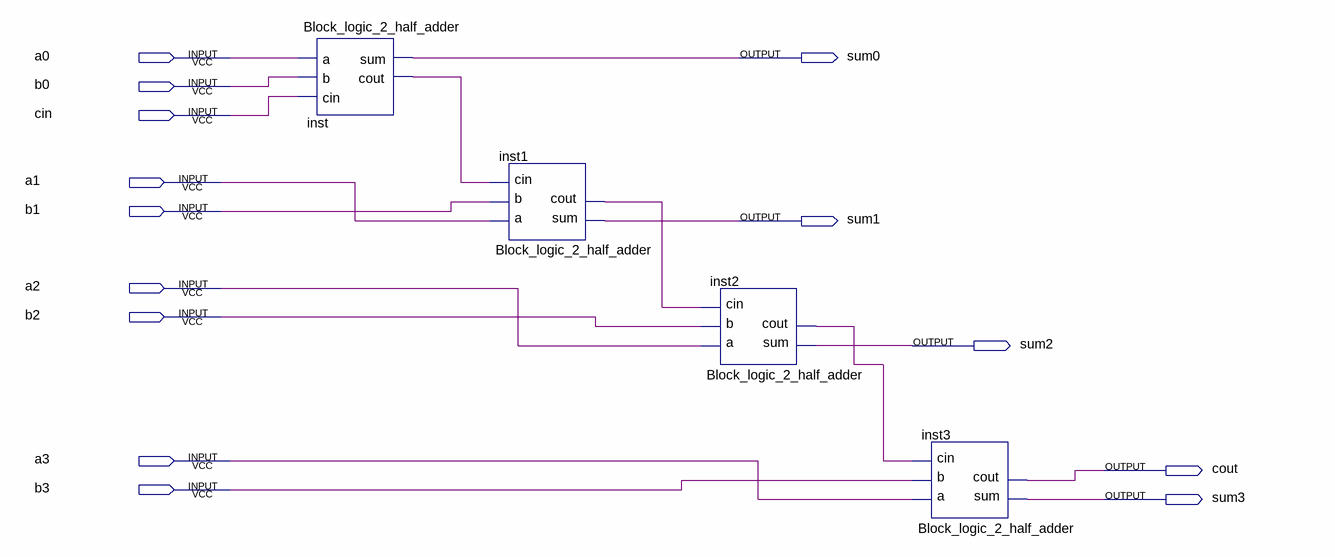
[diagram p0: schematic sheet]
// Quartus schematic Block_4_bit_full_adder.bdf as structural Verilog: 4 symbols, 14 pins
module Block_4_bit_full_adder (
  input  a0,
  input  b0,
  input  cin,
  input  a1,
  input  b1,
  input  a2,
  input  b2,
  input  a3,
  input  b3,
  output sum0,
  output sum1,
  output sum2,
  output cout,
  output sum3
);

  wire inst1_cout, inst2_cout, inst_cout;

  Block_logic_2_half_adder inst (.a(a0), .b(b0), .cin(cin), .sum(sum0), .cout(inst_cout));
  Block_logic_2_half_adder inst1 (.a(a1), .b(b1), .cin(inst_cout), .sum(sum1), .cout(inst1_cout));
  Block_logic_2_half_adder inst2 (.a(a2), .b(b2), .cin(inst1_cout), .sum(sum2), .cout(inst2_cout));
  Block_logic_2_half_adder inst3 (.a(a3), .b(b3), .cin(inst2_cout), .sum(sum3), .cout(cout));
endmodule
